# Altium schematic sheet 大风车灯条2.SchDoc
size A4
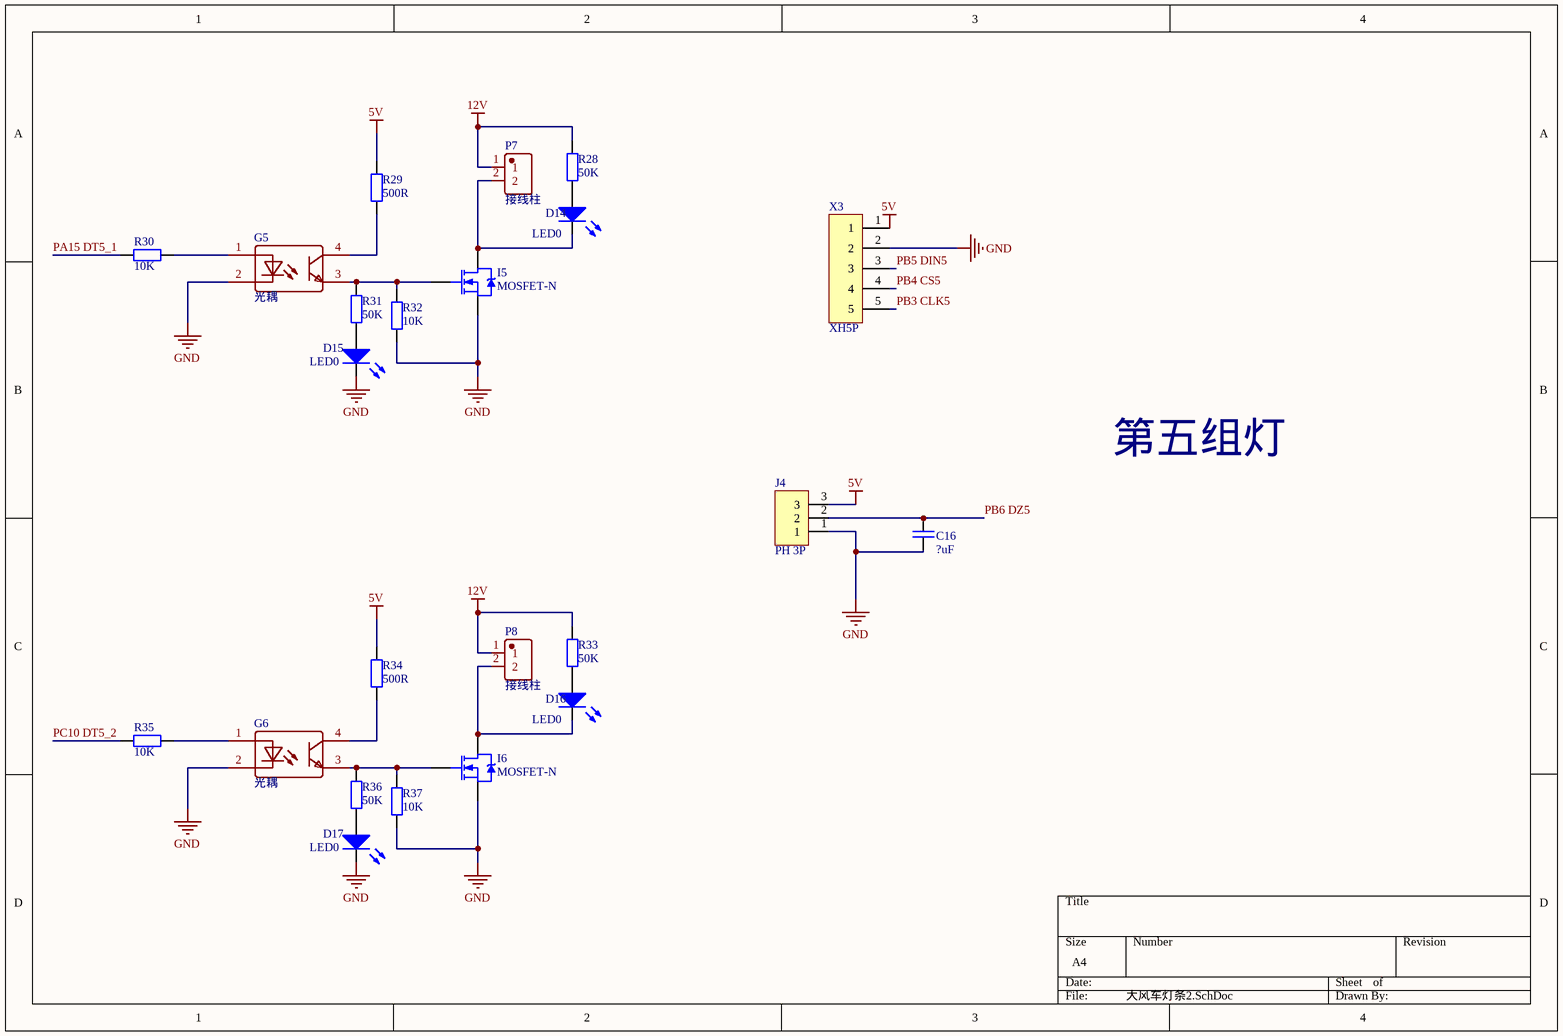
[diagram p0: 大风车灯条2.SchDoc]

## Parts
C16  ?uF  [0603_C]
D14  LED0  [LED-0603]
D15  LED0  [LED-0603]
D16  LED0  [LED-0603]
D17  LED0  [LED-0603]
G5  光耦  [SMD-4]
G6  光耦  [SMD-4]
I5  MOSFET-N  [VSONP-8]
I6  MOSFET-N  [VSONP-8]
J4  PH 3P  [PH3P]
P7  接线柱  [XT30-F]
P8  接线柱  [XT30-F]
R28  50K  [0603_R]
R29  500R  [0603_R]
R30  10K  [0603_R]
R31  50K  [0603_R]
R32  10K  [0603_R]
R33  50K  [0603_R]
R34  500R  [0603_R]
R35  10K  [0603_R]
R36  50K  [0603_R]
R37  10K  [0603_R]
X3  XH5P  [XH5P]

## Nets
5V: J4.3 R29.2 R34.2 X3.1
12V: P7.1 P8.1 R28.2 R33.2
GND: C16.1 D15.2(K) D17.2(K) G5.2(CAT) G6.2(CAT) I5.S I6.S J4.1 R32.1 R37.1 X3.2
PA15 DT5_1: R30.1
PB3 CLK5: X3.5
PB4 CS5: X3.4
PB5 DIN5: X3.3
PB6 DZ5: C16.2 J4.2
PC10 DT5_2: R35.1
NetD14_1: D14.1(A) R28.1
NetD14_2: D14.2(K) I5.D P7.2
NetD15_1: D15.1(A) R31.1
NetD16_1: D16.1(A) R33.1
NetD16_2: D16.2(K) I6.D P8.2
NetD17_1: D17.1(A) R36.1
NetG5_1: G5.1(AN) R30.2
NetG5_3: G5.3(EM) I5.G R31.2 R32.2
NetG5_4: G5.4(COL) R29.1
NetG6_1: G6.1(AN) R35.2
NetG6_3: G6.3(EM) I6.G R36.2 R37.2
NetG6_4: G6.4(COL) R34.1

## Notes on the sheet
- 第五组灯

## Library data of the parts
C16 = Cap: Published: 8-Jun-2000; LatestRevisionDate: 17-Jul-2002; LatestRevisionNote: Re-released for DXP Platform.; PackageReference: RAD-0.3; Publisher: Altium Limited
D14-D17 = LED0: 发光二极管; Published: 8-Jun-2000; LatestRevisionDate: 08-Jul-2005; LatestRevisionNote: Mech Layer 1 removed.; PackageReference: LED-0; Publisher: Altium Limited
R28-R37 = Res: Published: 8-Jun-2000; LatestRevisionDate: 17-Jul-2002; LatestRevisionNote: Re-released for DXP Platform.; PackageReference: AXIAL-0.4; Publisher: Altium Limited